# EAGLE design nu-multi-6-mounting_board (EAGLE 9.6.1)
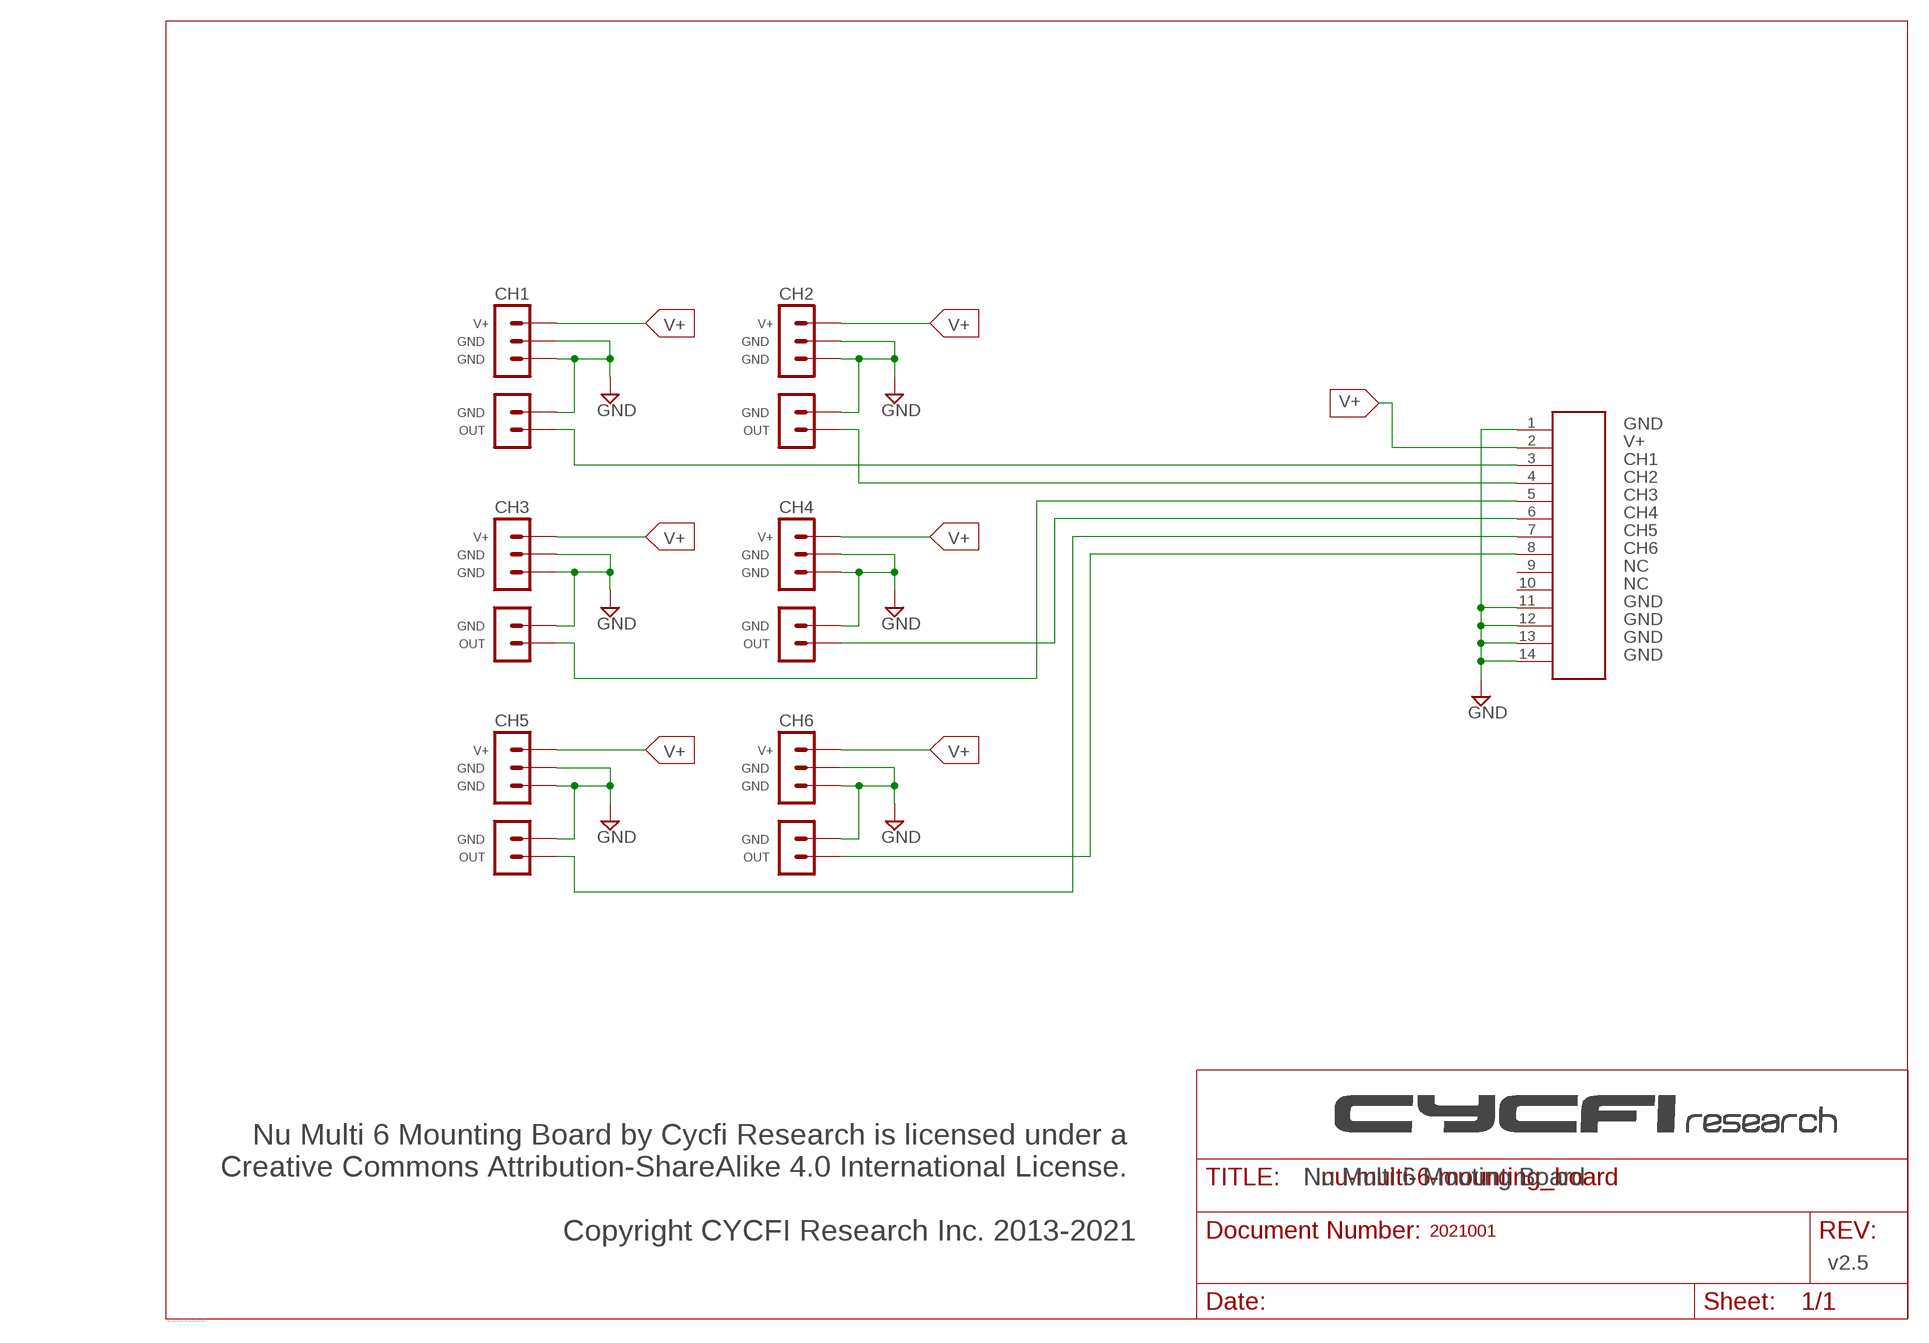
[diagram p0: schematic, sheet 1]

## Parts
CH1  NU-CAPSULE  [NU-CAPSULE]
CH2  NU-CAPSULE  [NU-CAPSULE]
CH3  NU-CAPSULE  [NU-CAPSULE]
CH4  NU-CAPSULE  [NU-CAPSULE]
CH5  NU-CAPSULE  [NU-CAPSULE]
CH6  NU-CAPSULE  [NU-CAPSULE]
U$1  2X7-1MM-HEADER  [2X7-1MM]

## Nets
CH1: CH1.P$5(P5) U$1.3
CH2: CH2.P$5(P5) U$1.4
CH3: CH3.P$5(P5) U$1.5
CH4: CH4.P$5(P5) U$1.6
CH5: CH5.P$5(P5) U$1.7
CH6: CH6.P$5(P5) U$1.8
GND: CH1.P$2(P2) CH1.P$3(P3) CH1.P$4(P4) CH2.P$2(P2) CH2.P$3(P3) CH2.P$4(P4) CH3.P$2(P2) CH3.P$3(P3) CH3.P$4(P4) CH4.P$2(P2) CH4.P$3(P3) CH4.P$4(P4) CH5.P$2(P2) CH5.P$3(P3) CH5.P$4(P4) CH6.P$2(P2) CH6.P$3(P3) CH6.P$4(P4) U$1.1 U$1.11 U$1.12 U$1.13 U$1.14
V+: CH1.P$1(P1) CH2.P$1(P1) CH3.P$1(P1) CH4.P$1(P1) CH5.P$1(P1) CH6.P$1(P1) U$1.2
Unconnected: U$1.9 U$1.10

## Notes on the sheet
- GND
- V+
- CH1
- CH2
- CH3
- CH4
- CH5
- CH6
- NC
- NC
- GND
- GND
- GND
- GND
- Nu Multi 6 Mouting Board
- 2021001
- Nu Multi 6 Mounting Board by Cycfi Research is licensed under a 
  Creative Commons Attribution-ShareAlike 4.0 International License. 
  
  Copyright CYCFI Research Inc. 2013-2021
- v2.5
- C:/Users/mark belarmino/Desktop/Logo-2016.bmp

## Library data of the parts
CH1-CH6 = Nu Capsule_updated:NU-CAPSULE
U$1 = CYCFI_Con:2X7-1MM-HEADER

## Board
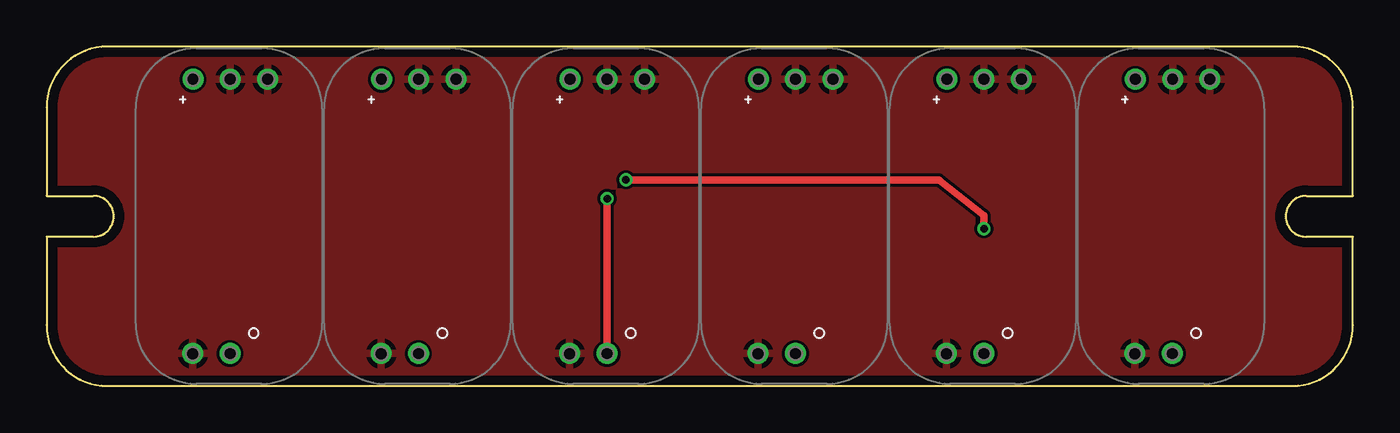
[diagram p1: board, top side]
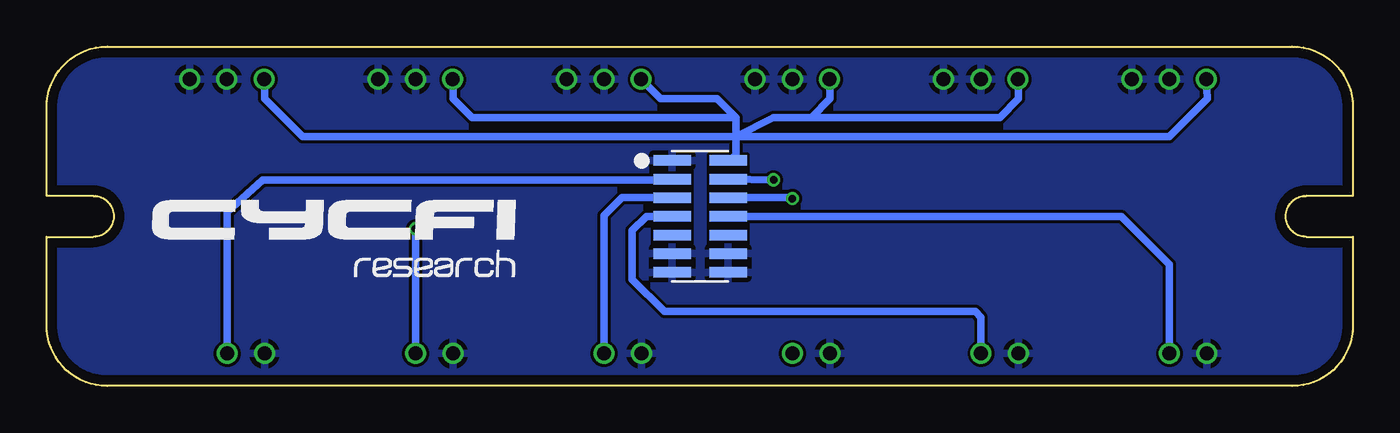
[diagram p2: board, bottom side, seen from below]

Size 70 x 18.2 mm. Coordinates in mm from the lower left corner, seen from the top.
Outline: 3.25,18.2 arc90 0,14.95 0,10.2 2.5,10.2 arc-180 2.5,8 0,8 0,3.25 arc90 3.25,0 66.75,0 arc90 70,3.25 70,8 67.5,8 arc-180 67.5,10.2 70,10.2 70,14.95 arc90 66.75,18.2 3.25,18.2
Copper layers (1*16): Top 0.035mm / dielectric 1.6mm / Bottom 0.035mm
Design rules "Elecrow_2-layer_PCB_eagle_rule": minimum track width 6mil, minimum drill 12mil, track to track 6mil, track to pad 6mil, pad to pad 6mil, via to via 8mil, smd to smd 0mil, copper to edge 20mil, drill to drill 10mil, minimum pad ring 6mil, minimum via ring 6mil, stop-mask expansion 0mil, vias tented up to drill 100mil, thermal gap 10mil

### Footprints (pad centres in the part's own frame; a part is rotated, then mirrored left to right if it is on the bottom)
NU-CAPSULE = drill 0.75: P$1 -1.992,6.34; P$2 0.008,6.34; P$3 2.008,6.34; P$4 -2.005,-8.372; P$5 -0.005,-8.372
2X7-1MM = smd 2 x 0.56: 1 0,0; 2 3,0; 3 0,-1; 4 3,-1; 5 0,-2; 6 3,-2; 7 0,-3; 8 3,-3; 9 0,-4; 10 3,-4; 11 0,-5; 12 3,-5; 13 0,-6; 14 3,-6

### Placement (x,y rotation side)
CH1  60.33,10.11 0 top
CH2  50.23,10.11 0 top
CH3  40.13,10.11 0 top
CH4  30.03,10.11 0 top
CH5  19.93,10.11 0 top
CH6  9.83,10.11 0 top
U$1  36.48,12.1 0 bottom

### Tracks (layer width: path | path; a pad name or v marks a point on that pad's centre or on a via)
CH1
  Bottom 0.406: CH1.P$5 60.33,9.34 58.41,11.06 37.51,11.06 U$1.3
CH2  (via drill 0.4)
  Top 0.406: v50.23,8.43 50.23,9.14 47.81,11.06 v31.04,11.06
  Bottom 0.406: CH2.P$5 v50.23,8.43 | v31.04,11.06 U$1.4
CH3
  Bottom 0.406: CH3.P$5 40.13,9.13 40.13,9.14 39.4,9.87 39.22,10.05 39.17,10.1 U$1.5
CH4  (via drill 0.4)
  Top 0.406: CH4.P$5 v30.03,10.04 v30.03,10.05
  Bottom 0.406: U$1.6 30.08,10.1 v30.03,10.05
CH5
  Bottom 0.406: CH5.P$5 19.93,3.68 20.24,3.99 36.9,3.99 38.62,5.7 38.62,8.33 37.85,9.1 U$1.7
CH6
  Bottom 0.406: CH6.P$5 9.83,6.51 12.42,9.1 13.63,9.1 14.07,9.1 U$1.8
GND
  pour Bottom: -0.17,-0.59 -0.17,18.41 69.83,18.41 69.83,-0.59
  pour Top: -0.17,-0.59 -0.17,18.41 69.83,18.41 69.83,-0.59
V+
  Bottom 0.406: U$1.2 33.06,12.37 33.06,13.38 | 33.06,13.38 31.04,14.39 29.02,14.39 | 29.02,14.39 28.01,15.4 CH4.P$1 | CH3.P$1 37.1,15.4 34.07,15.4 33.06,14.39 | 33.06,14.39 33.06,13.38 | CH2.P$1 48.21,15.4 47.2,14.39 33.06,14.39 | CH1.P$1 58.31,15.4 56.29,13.38 33.06,13.38 | CH5.P$1 17.91,15.4 18.92,14.39 29.02,14.39 | CH6.P$1 7.81,15.4 9.83,13.38 33.06,13.38